# EAGLE schematic audiostick_v1 (EAGLE 9.4.2)
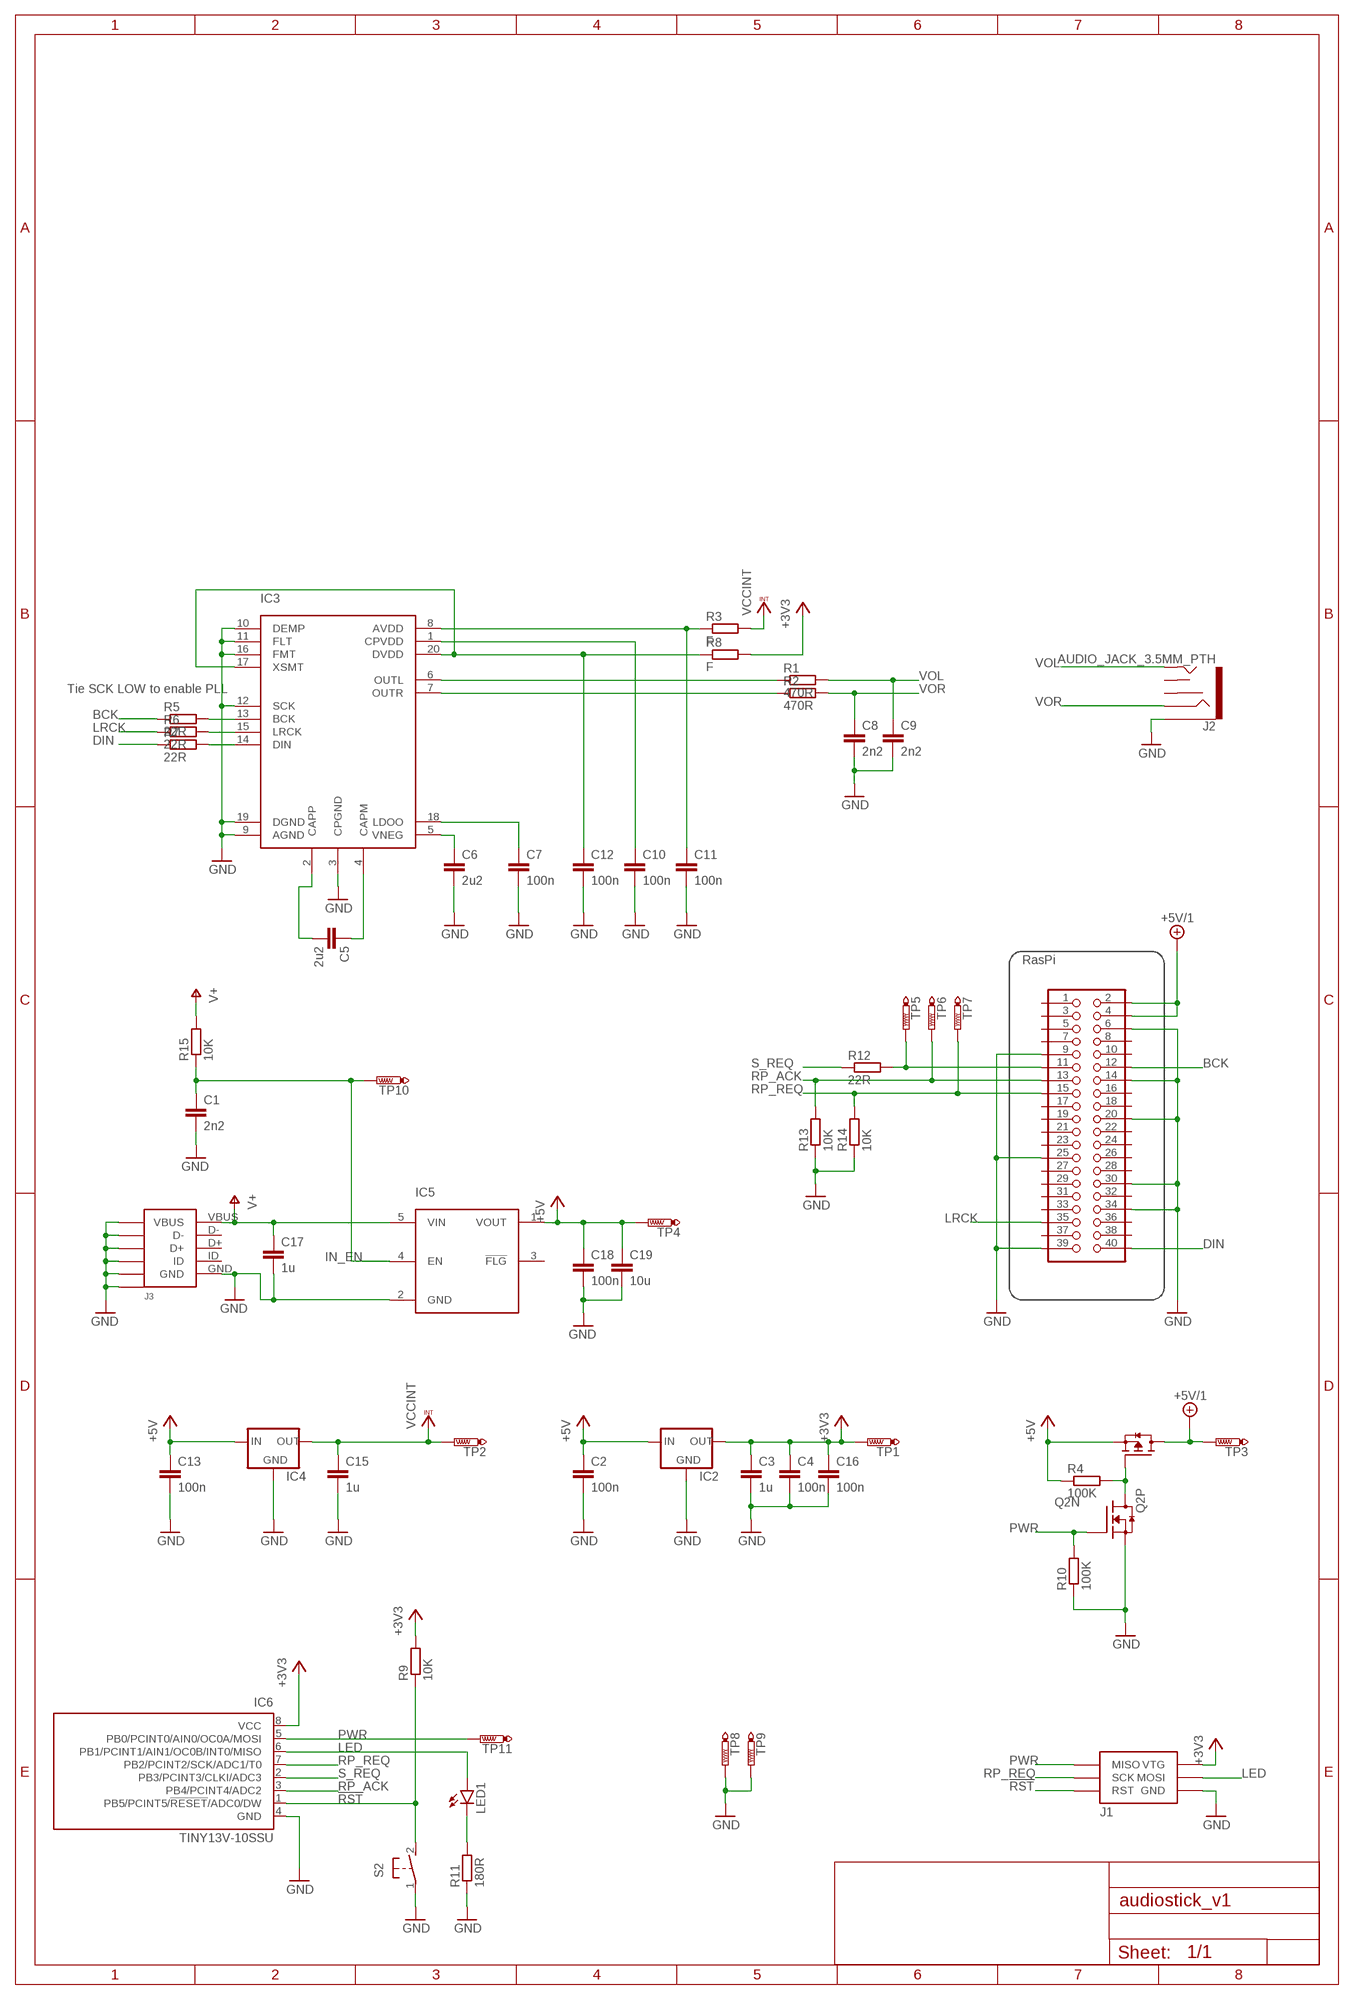
[diagram p0: schematic, sheet 1]

## Parts
C1  2n2  C-EUC0603  [C0603]
C2  100n  C-EUC0805  [C0805]
C3  1u  C-EUC0805  [C0805]
C4  100n  C-EUC0805  [C0805]
C5  2u2  C-EUC0603  [C0603]
C6  2u2  C-EUC0603  [C0603]
C7  100n  C-EUC0603  [C0603]
C8  2n2  C-EUC0603  [C0603]
C9  2n2  C-EUC0603  [C0603]
C10  100n  C-EUC0603  [C0603]
C11  100n  C-EUC0603  [C0603]
C12  100n  C-EUC0603  [C0603]
C13  100n  C-EUC0805  [C0805]
C15  1u  C-EUC0805  [C0805]
C16  100n  C-EUC0805  [C0805]
C17  1u  C-EUC0805  [C0805]
C18  100n  C-EUC0603  [C0603]
C19  10u  C-EUC0805  [C0805]
IC2  MCP1700TT  [SOT-23]
IC3  PCM5102ASW  [TSSOP20]
IC4  MCP1700TT  [SOT-23]
IC5  AP22804W5  [GHI_SOT23-5]
IC6  TINY13V-10SSU  [8S1]
J1  AVRISP6TH127  [2X3-50MIL]
J2  AUDIO_JACK_3.5MM_PTH  [AUDIO-JACK]
J3  USB-B  [1050170001]
LED1  LED3MM  [LED3MM]
Q2  BSL215  [6TSOP]
R1  470R  R-EU_R0603  [R0603]
R2  470R  R-EU_R0603  [R0603]
R3  F  R-EU_R0603  [R0603]
R4  100K  R-EU_R0805  [R0805]
R5  22R  R-EU_R0603  [R0603]
R6  22R  R-EU_R0603  [R0603]
R7  22R  R-EU_R0603  [R0603]
R8  F  R-EU_R0603  [R0603]
R9  10K  R-EU_R0603  [R0603]
R10  100K  R-EU_R0805  [R0805]
R11  180R  R-EU_R0805  [R0805]
R12  22R  R-EU_R0603  [R0603]
R13  10K  R-EU_R0603  [R0603]
R14  10K  R-EU_R0603  [R0603]
R15  10K  R-EU_R0603  [R0603]
S2  31-XX  [B3F-31XX]
TP1  PTR1PAD1-13  [P1-13]
TP2  PTR1PAD1-13  [P1-13]
TP3  PTR1PAD1-13  [P1-13]
TP4  PTR1PAD1-13  [P1-13]
TP5  PTR1PAD1-13  [P1-13]
TP6  PTR1PAD1-13  [P1-13]
TP7  PTR1PAD1-13  [P1-13]
TP8  PTR1PAD1-13  [P1-13]
TP9  PTR1PAD1-13  [P1-13]
TP10  PTR1PAD1-13  [P1-13]
TP11  PTR1PAD1-13  [P1-13]
U$1  RASPIZERO  [RASPIZERO]

## Nets
!RST: IC6.1(PB5/PCINT5/!RESET!/ADC0/DW) J1.5(RST) R9.1 S2.2(S)
+3V3: C3.1 C4.1 C16.1 IC2.2(OUT) IC6.8(VCC) J1.2(VTG) R8.2 R9.2 TP1.TP
+5V: C2.1 C13.1 C18.1 C19.1 IC2.3(IN) IC4.3(IN) IC5.1(VOUT) Q2.2(P:S) R4.1 TP4.TP
+5V/1: Q2.4(P:D) TP3.TP U$1.2(5V) U$1.4(5V)
BCK: R5.1 U$1.12
DIN: R7.1 U$1.40
GND: C1.2 C2.2 C3.2 C4.2 C6.2 C7.2 C8.2 C9.2 C10.2 C11.2 C12.2 C13.2 C15.2 C16.2 C17.2 C18.2 C19.2 IC2.1(GND) IC3.3(CPGND) IC3.9(AGND) IC3.10(DEMP) IC3.11(FLT) IC3.12(SCK) IC3.16(FMT) IC3.19(DGND) IC4.1(GND) IC5.2(GND) IC6.4(GND) J1.6(GND) J2.SLEEVE J3.GND J3.P$1(SH1*4) J3.P$2(SH1*1) J3.P$3(SH1*2) J3.P$4(SH1*3) J3.P$10(SH1*5) J3.P$11(SH1*6) Q2.5(N:S) R10.1 R11.1 R13.1 R14.1 S2.1(P) TP8.TP TP9.TP U$1.6(GND) U$1.9(GND) U$1.14(GND) U$1.20(GND) U$1.25(GND) U$1.30(GND) U$1.34(GND) U$1.39(GND)
IN_EN: C1.1 IC5.4(EN) R15.1 TP10.TP
LED: IC6.6(PB1/PCINT1/AIN1/OC0B/INT0/MISO) J1.4(MOSI) LED1.A
LRCK: R6.1 U$1.35
N$1: C5.1 IC3.4(CAPM)
N$2: C5.2 IC3.2(CAPP)
N$3: C6.1 IC3.5(VNEG)
N$4: C7.1 IC3.18(LDOO)
N$5: IC3.6(OUTL) R1.1
N$6: Q2.3(P:G) Q2.6(N:D) R4.2
N$7: C10.1 IC3.1(CPVDD)
N$8: IC3.7(OUTR) R2.1
N$9: IC3.13(BCK) R5.2
N$10: IC3.15(LRCK) R6.2
N$11: IC3.14(DIN) R7.2
N$12: C12.1 IC3.17(XSMT) IC3.20(DVDD) R8.1
N$14: C11.1 IC3.8(AVDD) R3.1
N$15: LED1.K(C) R11.2
PWR: IC6.5(PB0/PCINT0/AIN0/OC0A/MOSI) J1.1(MISO) Q2.1(N:G) R10.2 TP11.TP
RP_ACK: IC6.3(PB4/PCINT4/ADC2) R13.2 TP6.TP U$1.13
RP_REQ: IC6.7(PB2/PCINT2/SCK/ADC1/T0) J1.3(SCK) R14.2 TP7.TP U$1.15
S_REQ: IC6.2(PB3/PCINT3/CLKI/ADC3) R12.1
S_REQ': R12.2 TP5.TP U$1.11
V+: C17.1 IC5.5(VIN) J3.VBUS R15.2
VCCINT: C15.1 IC4.2(OUT) R3.2 TP2.TP
VOL: C9.1 J2.TIP R1.2
VOR: C8.1 J2.RING R2.2
Unconnected: IC5.3(!FLG) J2.RSH J2.TSH J3.D+ J3.D- J3.ID U$1.1(3V3) U$1.3 U$1.5 U$1.7 U$1.8 U$1.10 U$1.16 U$1.17(3V3) U$1.18 U$1.19 U$1.21 U$1.22 U$1.23 U$1.24 U$1.26 U$1.27 U$1.28 U$1.29 U$1.31 U$1.32 U$1.33 U$1.36 U$1.37 U$1.38

## Notes on the sheet
- Tie SCK LOW to enable PLL

## Library data of the parts
C1-C13 C15-C19 = rcl:C-EU: CAPACITOR, European symbol; SPICEPREFIX: C
IC2 IC4 = AWJLEagleLib:MCP1700: Microchip MCP1700 positive regulator
IC3 = AudioStick:PCM5102A: Texas Instruments PCM5102A DAC
IC5 = AudioStick:AP22804: Diodes Incorporated AP228x4 inrush current limiter IC
IC6 = atmel:TINY13: 8-bit AVR Microcontroller with 1K Bytes In-System Programmable Flash Source: http://www.atmel.com/dyn/resources/prod_documents/2535S.pdf; MPN: ATTINY13V-10SSU; OC_FARNELL: 1455135; OC_NEWARK: 58M3773
J1 = AWJLEagleLib:AVRISP6: Atmel AVR 6-pin ISP header
J2 = SparkFun-Connectors:AUDIO_JACK_3.5MM: Audio Jack 3.5mm variants of PTH and SMT stereo audio jack with bypass switches. SparkFun Products: SparkFun SparkPunk Sound Kit <[https://www.sparkfun.com/products/11177]> - PTH MP3 Trigger <https://www.sparkfun.com/products/13720> -3.5mm SMD SparkFun PicoBoard <https://www.sparkfun.com/products/11888>- 2.5mm SMD; PROD_ID: CONN-08774; SF_ID: PRT-08032
J3 = AWJLEagleLib:USB-B: USB B (2.0) connector
LED1 = led:LED: LED OSRAM: - CHIPLED LG R971, LG N971, LY N971, LG Q971, LY Q971, LO R971, LY R971 LH N974, LH R974 LS Q976, LO Q976, LY Q976 LO Q996 - Hyper CHIPLED LW Q18S LB Q993, LB Q99A, LB R99A - SideLED LS A670, LO A670, LY A670, LG A670, LP A670 LB A673, LV A673, LT A673, LW A673 LH A674 LY A675 LS A676, LA A676, LO A676, LY A676, LW A676 LS A679, LY A679, LG A679 - Hyper Micro SIDELED® LS Y876, LA Y876, LO Y876, LY Y876 LT Y87S - SmartLED LW L88C, LW L88S LB L89C, LB L89S, LG L890 LS L89K, LO L89K, LY L89K LS L896, LA L896, LO L896, LY L896 - TOPLED LS T670, LO T670, LY T670, LG T670, LP T670 LSG T670, LSP T670, LSY T670, LOP T670, LYG T670 LG T671, LOG T671, LSG T671 LB T673, LV T673, LT T673, LW T673 LH T674 LS T676, LA T676, LO T676, LY T676, LB T676, LH T676, LSB T676, LW T676 LB T67C, LV T67C, LT T67C, LS T67K, LO T67K, LY T67K, LW E67C LS E67B, LA E67B, LO E67B, LY E67B, LB E67C, LV E67C, LT E67C LW T67C LS T679, LY T679, LG T679 LS T770, LO T770, LY T770, LG T770, LP T770 LB T773, LV T773, LT T773, LW T773 LH T774 LS E675, LA E675, LY E675, LS T675 LS T776, LA T776, LO T776, LY T776, LB T776 LHGB T686 LT T68C, LB T68C - Hyper Mini TOPLED® LB M676 - Mini TOPLED Santana® LG M470 LS M47K, LO M47K, LY M47K Source: http://www.osram.convergy.de LUXEON: - LUMILED® LXK2-PW12-R00, LXK2-PW12-S00, LXK2-PW14-U00, LXK2-PW14-V00 LXK2-PM12-R00, LXK2-PM12-S00, LXK2-PM14-U00 LXK2-PE12-Q00, LXK2-PE12-R00, LXK2-PE12-S00, LXK2-PE14-T00, LXK2-PE14-U00 LXK2-PB12-K00, LXK2-PB12-L00, LXK2-PB12-M00, LXK2-PB14-N00, LXK2-PB14-P00, LXK2-PB14-Q00 LXK2-PR12-L00, LXK2-PR12-M00, LXK2-PR14-Q00, LXK2-PR14-R00 LXK2-PD12-Q00, LXK2-PD12-R00, LXK2-PD12-S00 LXK2-PH12-R00, LXK2-PH12-S00 LXK2-PL12-P00, LXK2-PL12-Q00, LXK2-PL12-R00 Source: www.luxeon.com KINGBRIGHT: KA-3528ASYC Source: www.kingbright.com
Q2 = AWJLEagleLib:BSL215: Infineon BSL215 dual N/P MOSFET
R1-R15 = rcl:R-EU_: RESISTOR, European symbol; SPICEPREFIX: R
S2 = switch-omron:31-XX: OMRON SWITCH; MPN: B3F-3100; OC_FARNELL: 959704; OC_NEWARK: 36M3582
TP1-TP11 = testpad:PTR1: TEST PIN
U$1 = AWJLEagleLib:RASPI